# EAGLE design TapuinoMini (EAGLE 6.6.0)
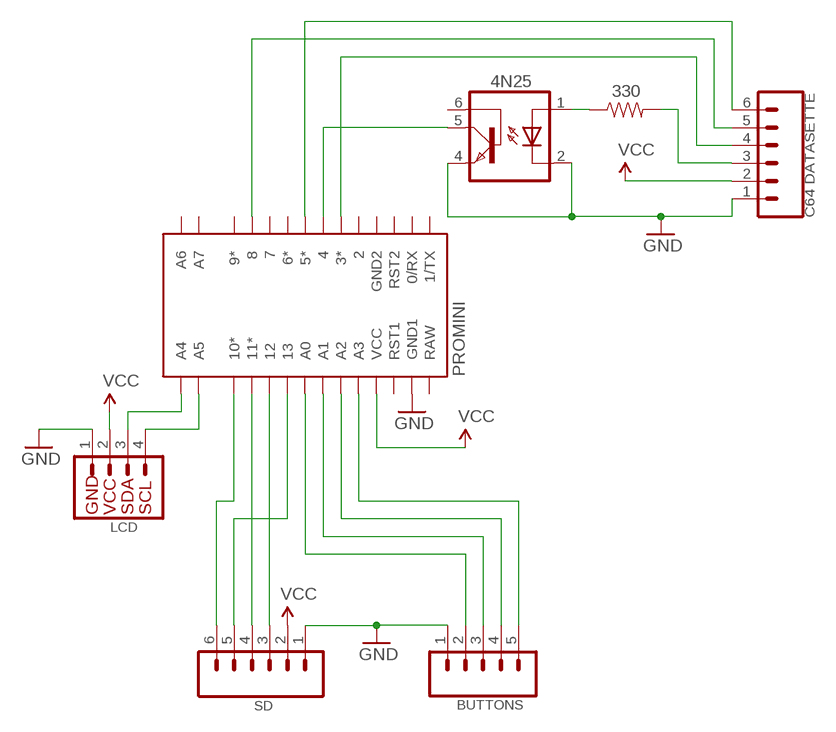
[diagram p0: schematic, sheet 1]

## Parts
JP1  C64 DATASETTE  M06SILK_FEMALE_PTH  [1X06]
JP2  SD  M06SILK_FEMALE_PTH  [1X06]
JP3  BUTTONS  M05PTH  [1X05]
JP4  LCD  I2C_STANDARD  [1X04]
OK1  4N25  4N35  [DIL06]
PROMINI  PROMINI_A  [PROMINI_A]
R1  330  RESISTORAXIAL-0.3  [AXIAL-0.3]

## Nets
GND: JP1.1 JP2.1 JP3.1 JP4.1 OK1.2(C) OK1.4(EMI) PROMINI.GND1
N$1: JP3.5 PROMINI.A3
N$2: JP3.4 PROMINI.A2
N$3: JP3.3 PROMINI.A1
N$4: JP3.2 PROMINI.A0
N$5: JP2.3 PROMINI.12
N$6: JP2.4 PROMINI.11*
N$7: JP2.6 PROMINI.10*
N$8: JP2.5 PROMINI.13
N$9: JP4.4 PROMINI.A5
N$10: JP4.3 PROMINI.A4
N$11: JP1.3 R1.P$2
N$12: OK1.1(A) R1.P$1
N$13: JP1.4 PROMINI.3*
N$14: OK1.5(COL) PROMINI.4
N$15: JP1.5 PROMINI.8
N$16: JP1.6 PROMINI.5*
VCC: JP1.2 JP2.2 JP4.2 PROMINI.VCC
Unconnected: OK1.6(BAS) PROMINI.0/RX PROMINI.1/TX PROMINI.2 PROMINI.6* PROMINI.7 PROMINI.9* PROMINI.A6 PROMINI.A7 PROMINI.GND2 PROMINI.RAW PROMINI.RST1 PROMINI.RST2

## Library data of the parts
JP1 JP2 = SparkFun-Connectors:M06: Header 6 Standard 6-pin 0.1" header. Use with straight break away headers (SKU : PRT-00116), right angle break away headers (PRT-00553), swiss pins (PRT-00743), machine pins (PRT-00117), and female headers (PRT-00115). Molex polarized connector foot print use with SKU : PRT-08094 with associated crimp pins and housings. NOTES ON THE VARIANTS LOCK and LOCK_LONGPADS... This footprint was designed to help hold the alignment of a through-hole component (i.e. 6-pin header) while soldering it into place. You may notice that each hole has been shifted either up or down by 0.005 of an inch from it's more standard position (which is a perfectly straight line). This slight alteration caused the pins (the squares in the middle) to touch the edges of the holes. Because they are alternating, it causes a "brace" to hold the component in place. 0.005 has proven to be the perfect amount of "off-center" position when using our standard breakaway headers. Although looks a little odd when you look at the bare footprint, once you have a header in there, the alteration is very hard to notice. Also,if you push a header all the way into place, it is covered up entirely on the bottom side. This idea of altering the position of holes to aid alignment will be further integrated into the Sparkfun Library for other footprints. It can help hold any component with 3 or more connection pins.; PROD_ID: CONN-08437
JP3 = SparkFun-Connectors:M05: Header 5 Standard 5-pin 0.1" header. Use with straight break away headers (SKU : PRT-00116), right angle break away headers (PRT-00553), swiss pins (PRT-00743), machine pins (PRT-00117), and female headers (PRT-00115). Molex polarized connector foot print use with SKU : PRT-08230 with associated crimp pins and housings.
JP4 = SparkFun-Connectors:I2C_STANDARD: SparkFun has standardized on a pinout for all I2C based sensor breakouts. This pinout allows I2C boards to be plugged directly into the headers on Arduino Uno compatible boards, and to be daisy chained easily.
OK1 = optocoupler:4N35: MOTOROLA OPTO COUPLER; MF: FAIRCHILD SEMICONDUCTOR; MPN: 4N35; OC_FARNELL: 1328375; OC_NEWARK: 72K9946
PROMINI = arduino:PROMINI: Arduino Pro Mini
R1 = SparkFun-Passives:RESISTOR: Resistor Basic schematic elements and footprints for 0603, 1206, and PTH resistors.

## Board
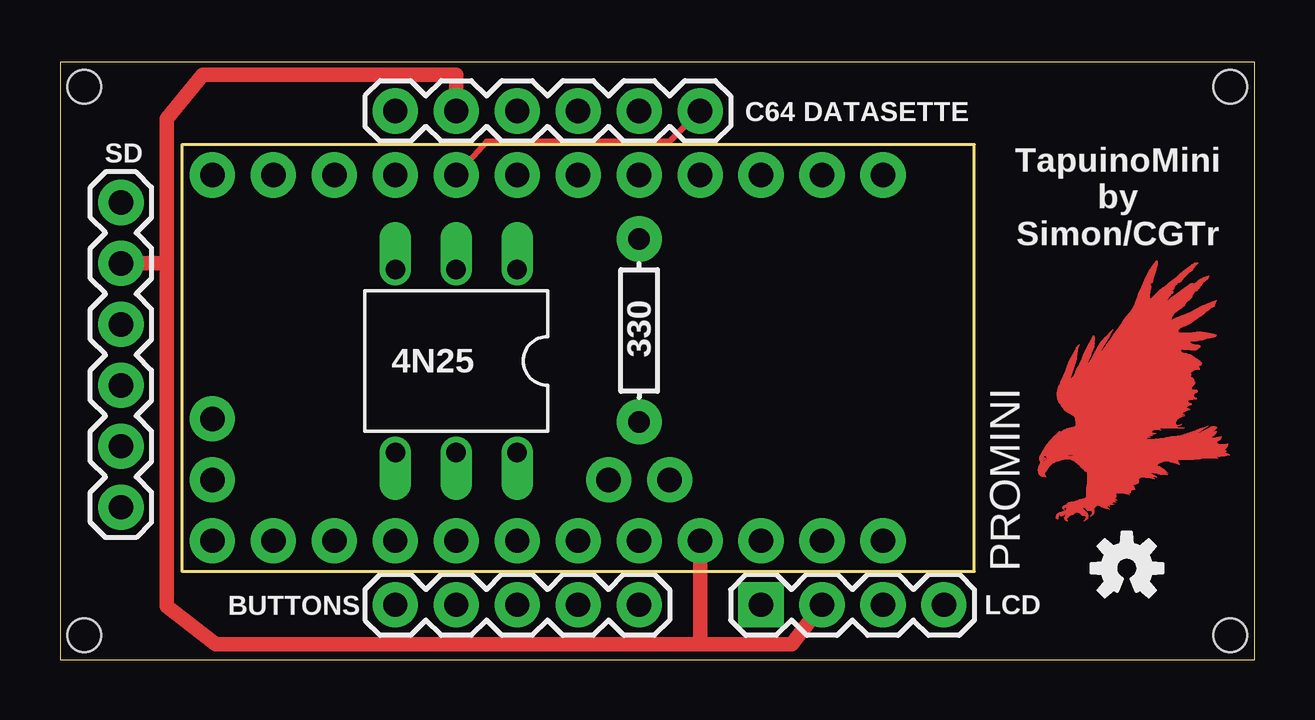
[diagram p1: board, top side]
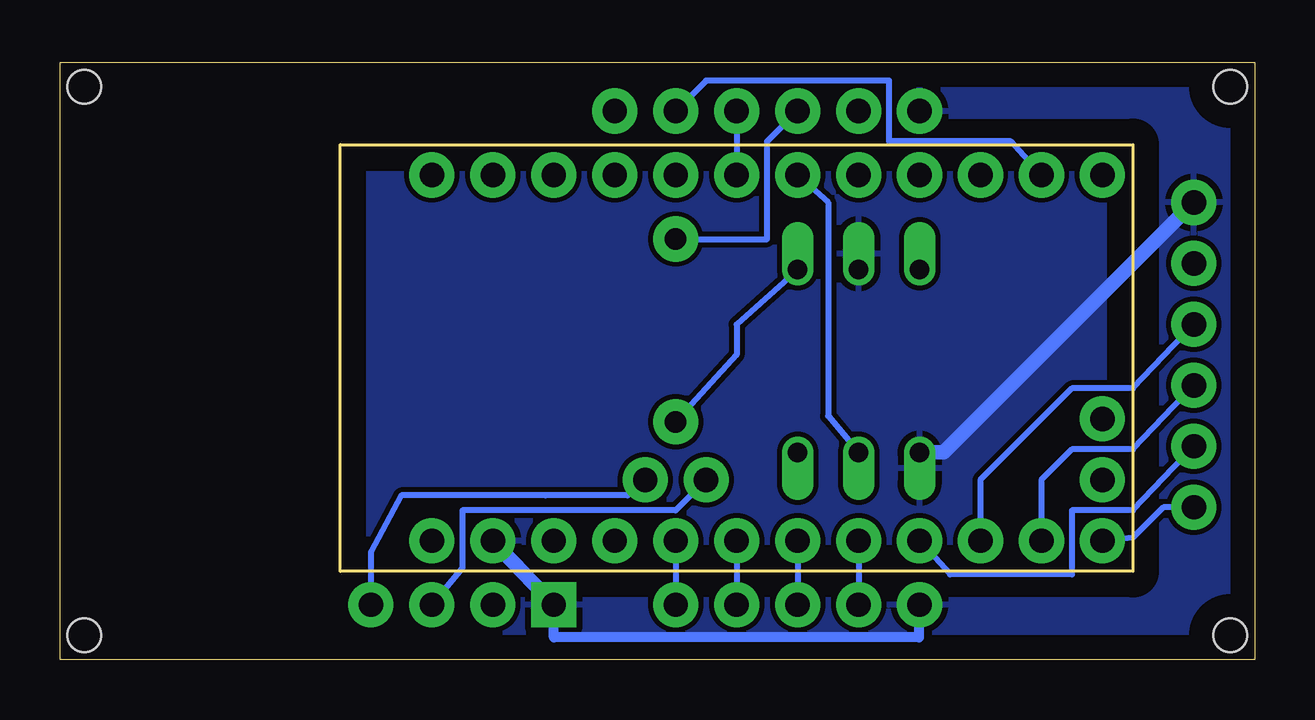
[diagram p2: board, bottom side, seen from below]

Size 49.78 x 24.89 mm. Coordinates in mm from the lower left corner, seen from the top.
Outline: 0,0 49.78,0 49.78,24.89 0,24.89 0,0
Copper layers (1*16): Top 0.035mm / dielectric 1.5mm / Bottom 0.035mm
Design rules "default": minimum track width 10mil, minimum drill 24mil, track to track 8mil, track to pad 8mil, pad to pad 8mil, via to via 8mil, smd to smd 8mil, copper to edge 40mil, drill to drill 8mil, minimum pad ring 10mil, minimum via ring 8mil, stop-mask expansion 4mil, vias tented up to drill 0mil, thermal gap 10mil
Holes 1.4 mm at 1.02,23.88 48.77,23.88 1.02,1.02 48.77,1.02

### Footprints (pad centres in the part's own frame; a part is rotated, then mirrored left to right if it is on the bottom)
1X06 = drill 1.016 pad 1.88: 1 0,0; 2 2.54,0; 3 5.08,0; 4 7.62,0; 5 10.16,0; 6 12.7,0
1X05 = drill 1.016 pad 1.88: 1 0,0; 2 2.54,0; 3 5.08,0; 4 7.62,0; 5 10.16,0
1X04 = drill 1.016 pad 1.88 square: 1 0,0 | drill 1.016 pad 1.88: 2 2.54,0; 3 5.08,0; 4 7.62,0
DIL06 = drill 0.813 offset: 1 -2.54,-3.81; 2 0,-3.81; 3 2.54,-3.81; 4 2.54,3.81; 5 0,3.81; 6 -2.54,3.81
PROMINI_A = drill 1.016 pad 1.88: 0/RX 10.16,7.62; 1/TX 12.7,7.62; 2 2.54,7.62; 3* 0,7.62; 4 -2.54,7.62; 5* -5.08,7.62; 6* -7.62,7.62; 7 -10.16,7.62; 8 -12.7,7.62; 9* -15.24,7.62; 10* -15.24,-7.62; 11* -12.7,-7.62; 12 -10.16,-7.62; 13 -7.62,-7.62; A0 -5.08,-7.62; A1 -2.54,-7.62; A2 0,-7.62; A3 2.54,-7.62; A4 1.27,-5.08; A5 3.81,-5.08; A6 -15.24,-2.54; A7 -15.24,-5.08; GND1 10.16,-7.62; GND2 5.08,7.62; RAW 12.7,-7.62; RST1 7.62,-7.62; RST2 7.62,7.62; VCC 5.08,-7.62
AXIAL-0.3 = drill 0.9 pad 1.88: P$1 -3.81,0; P$2 3.81,0

### Placement (x,y rotation side)
JP1  13.97,22.86 0 top
JP2  2.54,19.05 270 top
JP3  13.97,2.29 0 top
JP4  29.21,2.29 0 top
OK1  16.51,12.45 180 top
PROMINI  21.59,12.57 0 top
R1  24.13,13.72 90 top
U$2  [EAGLE-TOP-8MM]  40.76,5.76 0 top
U$3  [OSHW-LOGO-S]  44.45,3.81 0 top

### Tracks (layer width: path | path; a pad name or v marks a point on that pad's centre or on a via)
GND
  Bottom 0.254: 13.97,8.89 OK1.4
  Bottom 0.406: JP3.1 14,2.29 14,0.93 29.21,0.93 JP4.1
  Bottom 0.61: JP4.1 PROMINI.GND1 | OK1.4 12.95,8.64 JP2.1
  pour Bottom: 0,24.89 0,0 49.78,0 49.78,24.89
N$1
  Bottom 0.254: PROMINI.A3 JP3.5
N$2
  Bottom 0.254: PROMINI.A2 JP3.4
N$3
  Bottom 0.254: PROMINI.A1 JP3.3
N$4
  Bottom 0.254: PROMINI.A0 JP3.2
N$5
  Bottom 0.254: JP2.3 5.08,11.3 7.62,11.3 11.43,7.49 PROMINI.12
N$6
  Bottom 0.254: JP2.4 5.08,8.76 7.62,8.76 8.89,7.49 PROMINI.11*
N$7
  Bottom 0.254: JP2.6 3.81,6.35 5.08,5.08 PROMINI.10*
N$8
  Bottom 0.254: JP2.5 5.08,6.22 7.62,6.22 7.62,3.56 12.7,3.56 PROMINI.13
N$9
  Bottom 0.254: PROMINI.A5 26.14,6.84 29.56,6.84 35.56,6.84 36.83,4.48 JP4.4
N$10
  Bottom 0.254: PROMINI.A4 24.13,6.22 33.02,6.22 33.02,3.81 JP4.3
N$11
  Bottom 0.254: R1.P$2 20.32,17.53 20.32,21.59 JP1.3
N$12
  Bottom 0.254: OK1.1 21.59,13.97 21.59,12.7 R1.P$1
N$13
  Bottom 0.254: JP1.4 PROMINI.3*
N$14
  Bottom 0.254: PROMINI.4 17.78,19.05 17.78,10.16 OK1.5
N$15
  Bottom 0.254: PROMINI.8 10.16,21.59 15.24,21.59 15.24,24.13 22.86,24.13 JP1.5
N$16
  Top 0.254: PROMINI.5* 17.78,21.59 25.4,21.59 JP1.6
VCC
  Top 0.61: 4.45,16.51 JP2.2 | 4.45,16.51 4.45,22.54 5.96,24.38 16.51,24.38 JP1.2 | JP4.2 30.48,0.64 26.67,0.64 | 4.45,16.51 4.45,2.23 6.49,0.64 26.67,0.64 | PROMINI.VCC 26.67,0.64

### Text on the board
tNames: TapuinoMini / by / Simon/CGTr